# Altium schematic sheet switch-SS12D11-G5_2024-05-03.schdoc
size 52 x 37 mm
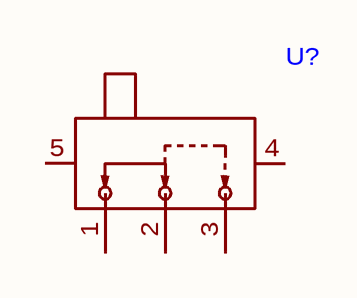
[diagram p0: switch-SS12D11-G5_2024-05-03.schdoc]

## Parts
U?  (no value)  [SW-TH_KH-SS12D11-G5]

## Nets

Not connected (* = marked no-connect by the designer): U? 1 2 3 4 5

## Library data of the parts
U? = KH-SS12D11-G5